# EAGLE schematic rev_a (EAGLE 9.2.2)

## Sheet 1 of 2
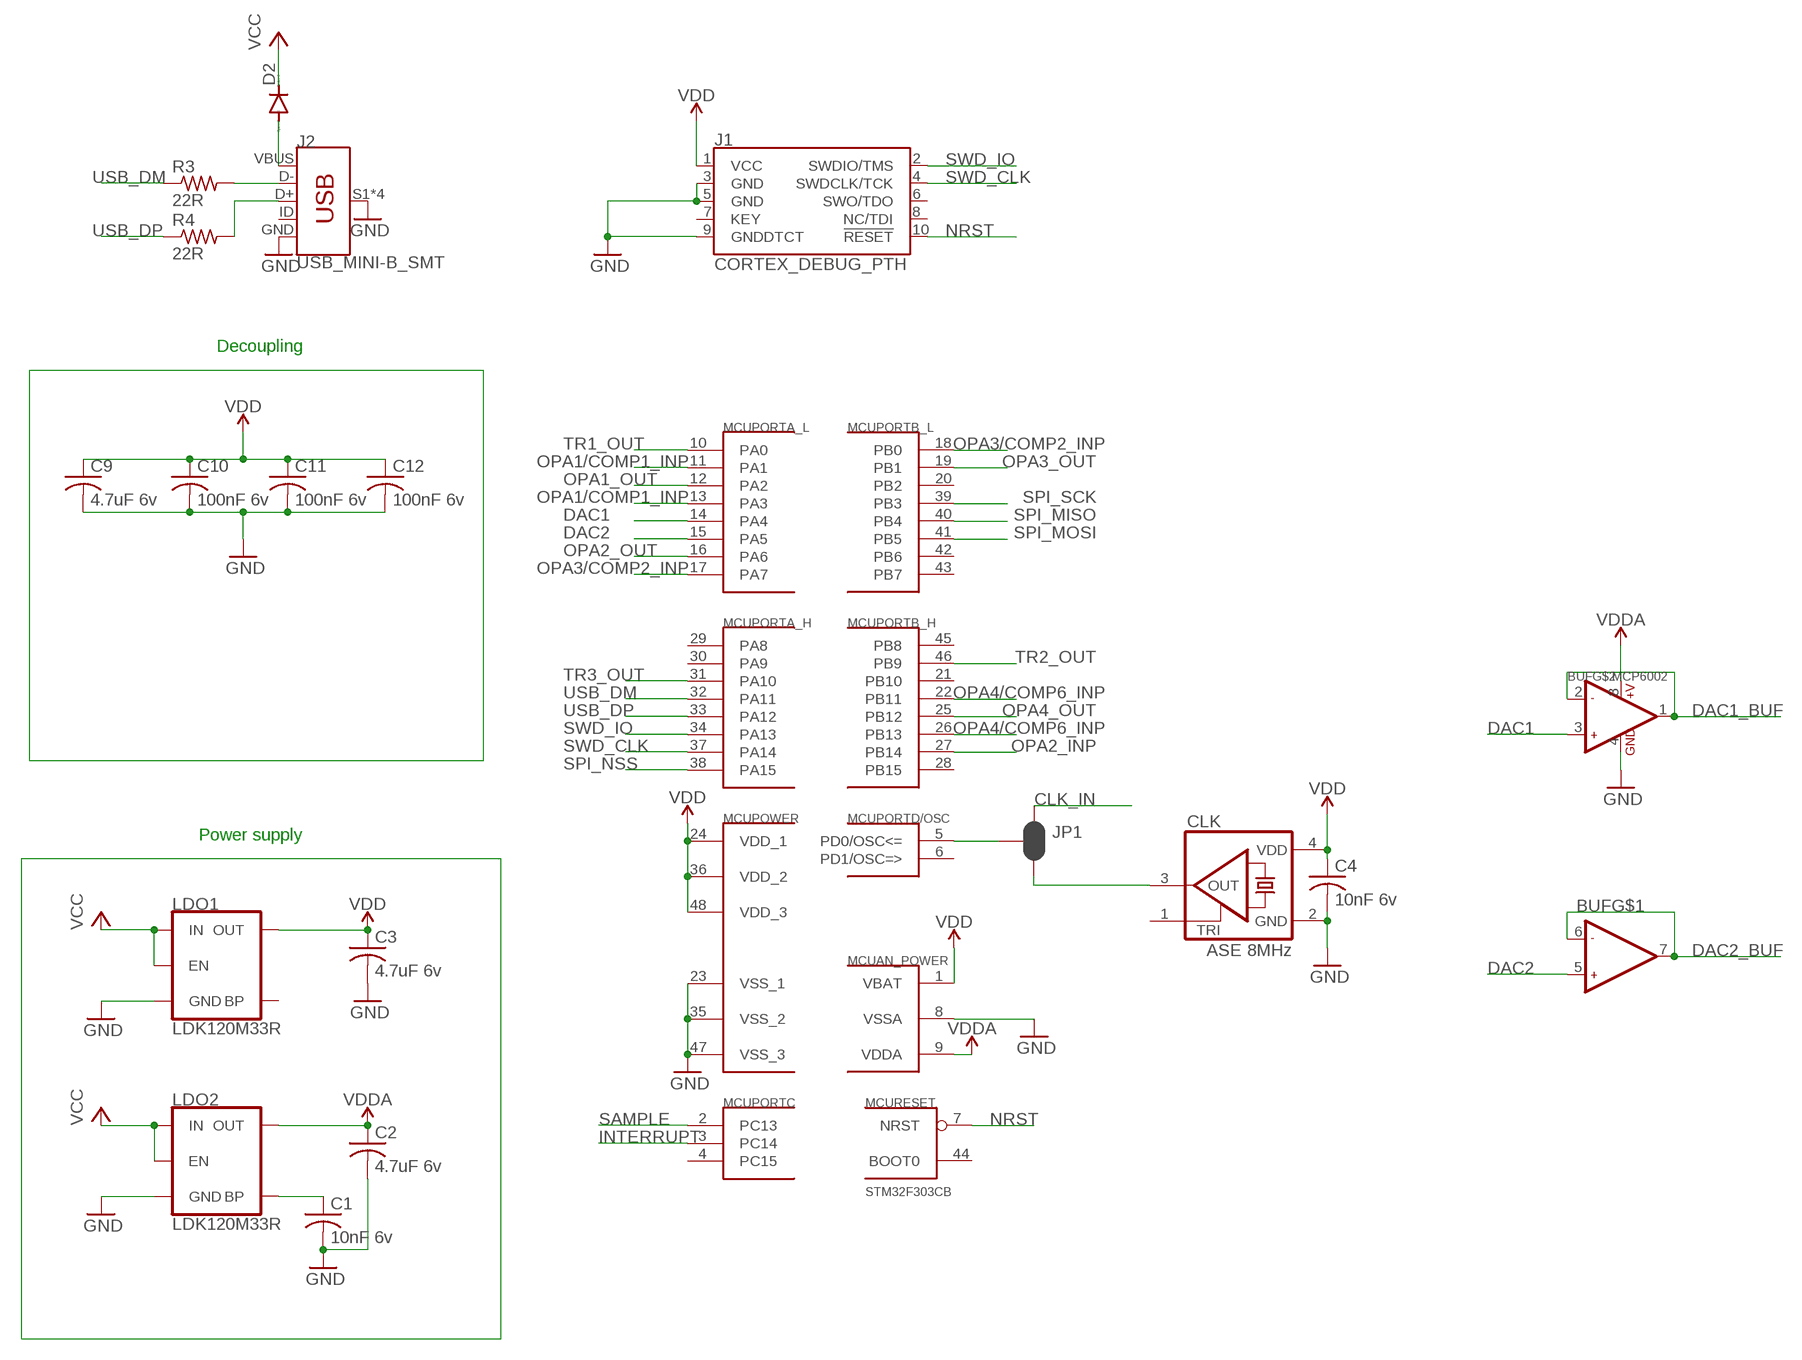
[diagram p0: schematic, sheet 1]

### Parts
BUF  MCP6002  AMPLIFIER-LMV358IDGKR(MSOP8)  [MSOP8-0.65-3X3MM]
C1  10nF 6v  C-USC0805  [C0805]
C2  4.7uF 6v  C-USC0805  [C0805]
C3  4.7uF 6v  C-USC0805  [C0805]
C4  10nF 6v  C-USC0805  [C0805]
C9  4.7uF 6v  C-USC0805  [C0805]
C10  100nF 6v  C-USC0805  [C0805]
C11  100nF 6v  C-USC0805  [C0805]
C12  100nF 6v  C-USC0805  [C0805]
CLK  ASE 8MHz  ASE  [ASE]
D2  DIODE-SOD323-R  [SOD323-R]
J1  CORTEX_DEBUG_PTH  [2X5-PTH-1.27MM]
J2  USB_MINI-B_SMT  [USB-MINIB]
JP1  JUMPER-SMT_3_2-NC_PASTE_SILK  [SMT-JUMPER_3_2-NC_PASTE_SILK]
LDO1  LDK120M33R  V_REG_MIC52053.3V  [SOT23-5]
LDO2  LDK120M33R  V_REG_MIC52053.3V  [SOT23-5]
MCU  STM32F303CB  STM32F10XCXT6  [LQFP48_2]
R3  22R  R-US_R0805  [R0805]
R4  22R  R-US_R0805  [R0805]

### Nets
CLK_IN: JP1.1
DAC1: BUF.3(+IN1) MCU.14(PORTA_L:PA4)
DAC1_BUF: BUF.1(OUT1) BUF.2(-IN1) ; also sheet 2
DAC2: BUF.5(+IN2) MCU.15(PORTA_L:PA5)
DAC2_BUF: BUF.6(-IN2) BUF.7(OUT2)
GND: BUF.4(GND) C1.2 C2.2 C3.2 C4.2 C9.2 C10.2 C11.2 C12.2 CLK.2(GND) J1.3(GND) J1.5(GND) J1.9(GNDDTCT) J2.GND J2.S1(SHIELD) J2.S2(SHIELD) J2.S3(SHIELD) J2.S4(SHIELD) LDO1.2(GND) LDO2.2(GND) MCU.8(AN_POWER:VSSA) MCU.23(POWER:VSS_1) MCU.35(POWER:VSS_2) MCU.47(POWER:VSS_3) ; also sheet 2
INTERRUPT: MCU.3(PORTC:PC14)
N$1: C1.1 LDO2.4(BP)
N$2: C4.1 CLK.4(VDD) ; supply symbol labelled VDD
N$3: J2.D+ R4.2
N$4: J2.D- R3.2
N$5: D2.A J2.VBUS
N$7: CLK.3(OUT) JP1.3
N$9: JP1.2 MCU.5(PORTD/OSC:PD0/OSC<=)
NRST: J1.10(!RESET) MCU.7(RESET:NRST)
OPA1/COMP1_INP: MCU.11(PORTA_L:PA1) MCU.13(PORTA_L:PA3) ; also sheet 2
OPA1_OUT: MCU.12(PORTA_L:PA2)
OPA2_INP: MCU.27(PORTB_H:PB14) ; also sheet 2
OPA2_OUT: MCU.16(PORTA_L:PA6)
OPA3/COMP2_INP: MCU.17(PORTA_L:PA7) MCU.18(PORTB_L:PB0) ; also sheet 2
OPA3_OUT: MCU.19(PORTB_L:PB1)
OPA4/COMP6_INP: MCU.22(PORTB_H:PB11) MCU.26(PORTB_H:PB13) ; also sheet 2
OPA4_OUT: MCU.25(PORTB_H:PB12)
SAMPLE: MCU.2(PORTC:PC13)
SPI_MISO: MCU.40(PORTB_L:PB4)
SPI_MOSI: MCU.41(PORTB_L:PB5)
SPI_NSS: MCU.38(PORTA_H:PA15)
SPI_SCK: MCU.39(PORTB_L:PB3)
SWD_CLK: J1.4(SWDCLK/TCK) MCU.37(PORTA_H:PA14)
SWD_IO: J1.2(SWDIO/TMS) MCU.34(PORTA_H:PA13)
TR1_OUT: MCU.10(PORTA_L:PA0)
TR2_OUT: MCU.46(PORTB_H:PB9)
TR3_OUT: MCU.31(PORTA_H:PA10)
USB_DM: MCU.32(PORTA_H:PA11) R3.1
USB_DP: MCU.33(PORTA_H:PA12) R4.1
VCC: D2.C LDO1.1(IN) LDO1.3(EN) LDO2.1(IN) LDO2.3(EN)
VDD: C3.1 C9.1 C10.1 C11.1 C12.1 J1.1(VCC) LDO1.5(OUT) MCU.1(AN_POWER:VBAT) MCU.24(POWER:VDD_1) MCU.36(POWER:VDD_2) MCU.48(POWER:VDD_3)
VDDA: BUF.8(+V) C2.1 LDO2.5(OUT) MCU.9(AN_POWER:VDDA) ; also sheet 2
Unconnected: CLK.1(TRI) J1.6(SWO/TDO) J1.7(KEY) J1.8(NC/TDI) J2.ID LDO1.4(BP) MCU.4(PORTC:PC15) MCU.6(PORTD/OSC:PD1/OSC=>) MCU.20(PORTB_L:PB2) MCU.21(PORTB_H:PB10) MCU.28(PORTB_H:PB15) MCU.29(PORTA_H:PA8) MCU.30(PORTA_H:PA9) MCU.42(PORTB_L:PB6) MCU.43(PORTB_L:PB7) MCU.44(RESET:BOOT0) MCU.45(PORTB_H:PB8)

### Notes on the sheet
- Decoupling
- Power supply

## Sheet 2 of 2
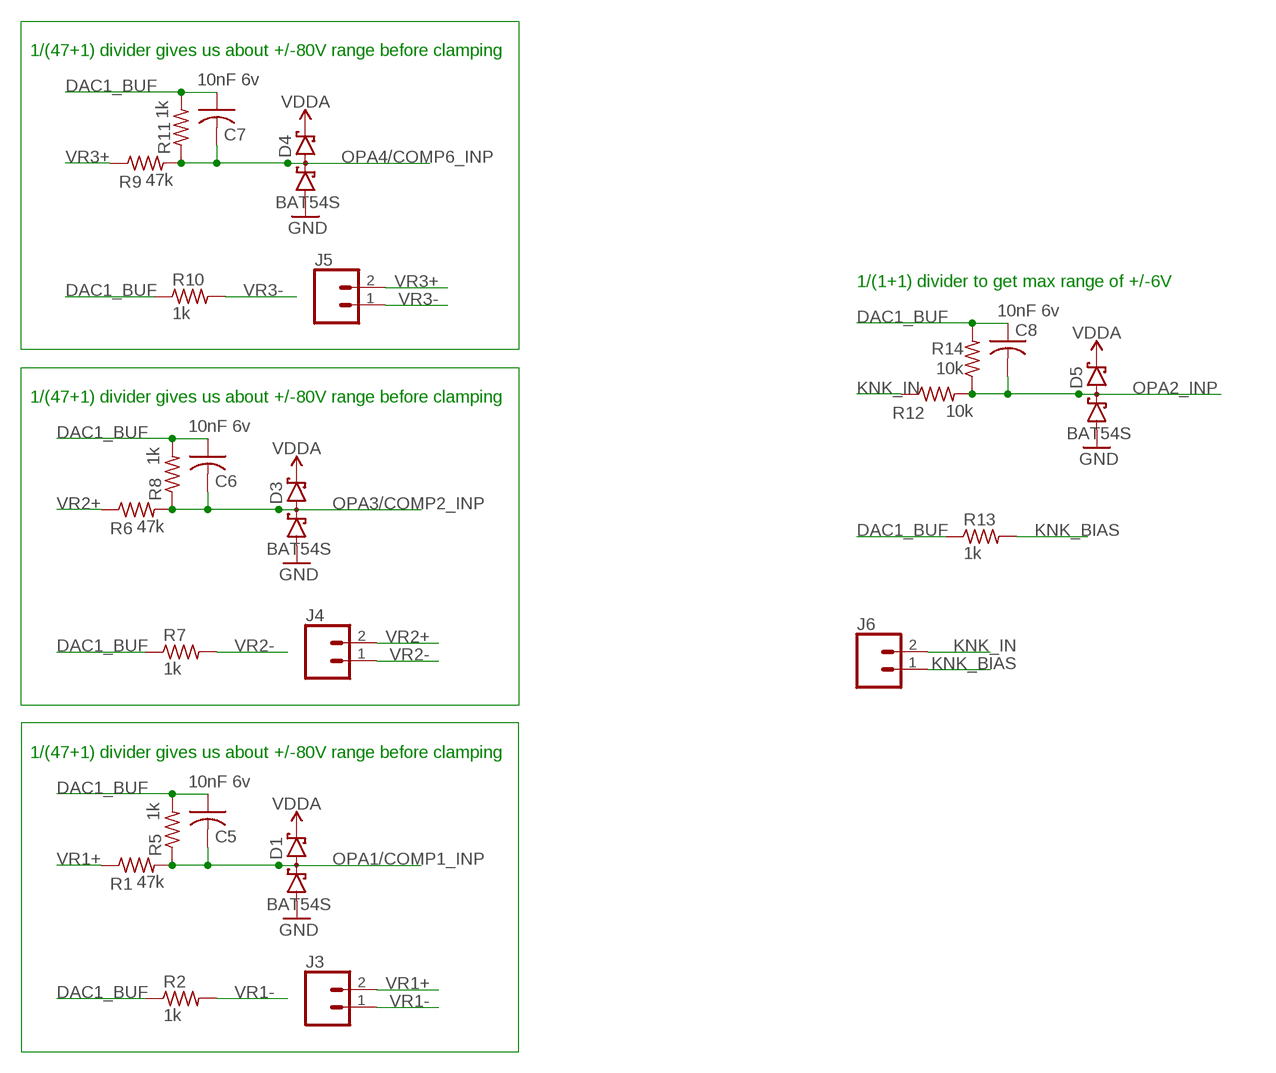
[diagram p1: schematic, sheet 2]

### Parts
C5  10nF 6v  C-USC0805  [C0805]
C6  10nF 6v  C-USC0805  [C0805]
C7  10nF 6v  C-USC0805  [C0805]
C8  10nF 6v  C-USC0805  [C0805]
D1  BAT54S  [SOT23]
D3  BAT54S  [SOT23]
D4  BAT54S  [SOT23]
D5  BAT54S  [SOT23]
J3  CONN_02LOCK  [1X02_LOCK]
J4  CONN_02LOCK  [1X02_LOCK]
J5  CONN_02LOCK  [1X02_LOCK]
J6  CONN_02LOCK  [1X02_LOCK]
R1  47k  R-US_R0805  [R0805]
R2  1k  R-US_R0805  [R0805]
R5  1k  R-US_R0805  [R0805]
R6  47k  R-US_R0805  [R0805]
R7  1k  R-US_R0805  [R0805]
R8  1k  R-US_R0805  [R0805]
R9  47k  R-US_R0805  [R0805]
R10  1k  R-US_R0805  [R0805]
R11  1k  R-US_R0805  [R0805]
R12  10k  R-US_R0805  [R0805]
R13  1k  R-US_R0805  [R0805]
R14  10k  R-US_R0805  [R0805]

### Nets
DAC1_BUF: C5.1 C6.1 C7.1 C8.1 R2.1 R5.2 R7.1 R8.2 R10.1 R11.2 R13.1 R14.2 ; also sheet 1
GND: D1.1(A1) D3.1(A1) D4.1(A1) D5.1(A1) ; also sheet 1
KNK_BIAS: J6.1 R13.2
KNK_IN: J6.2 R12.1
OPA1/COMP1_INP: C5.2 D1.3(C1A2) R1.2 R5.1 ; also sheet 1
OPA2_INP: C8.2 D5.3(C1A2) R12.2 R14.1 ; also sheet 1
OPA3/COMP2_INP: C6.2 D3.3(C1A2) R6.2 R8.1 ; also sheet 1
OPA4/COMP6_INP: C7.2 D4.3(C1A2) R9.2 R11.1 ; also sheet 1
VDDA: D1.2(C2) D3.2(C2) D4.2(C2) D5.2(C2) ; also sheet 1
VR1+: J3.2 R1.1
VR1-: J3.1 R2.2
VR2+: J4.2 R6.1
VR2-: J4.1 R7.2
VR3+: J5.2 R9.1
VR3-: J5.1 R10.2

### Notes on the sheet
- 1/(47+1) divider gives us about +/-80V range before clamping
- 1/(1+1) divider to get max range of +/-6V
- 1/(47+1) divider gives us about +/-80V range before clamping
- 1/(47+1) divider gives us about +/-80V range before clamping

## Library data of the parts
BUF = Seeed-IC:AMPLIFIER-LMV358IDGKR(MSOP8): 310020007; MPN: LMV358IDGKR; VALUE: LMV358IDGKR-MSOP8
C1-C12 = rcl:C-US: CAPACITOR, American symbol; SPICEPREFIX: C
CLK = crystal:ASE: 3.3Vdc CMOS SMD CRYSTAL CLOCK OSCILLATOR SOurce: www.abracon.com; OC_FARNELL: unknown; OC_NEWARK: unknown
D1 D3-D5 = diode:BAT54S: Schottky Diodes Pin connection corrected 2011-05-04 Source: Fairchild .. BAT54.pdf
D2 = diode:DIODE-: DIODE
J1 = SparkFun-Connectors:CORTEX_DEBUG: Cortex Debug Connector - 10 pin Supports JTAG debug, Serial Wire debug, and Serial Wire Viewer. PTH and SMD connector options available. General Connector Information <http://infocenter.arm.com/help/topic/com.arm.doc.faqs/attached/13634/cortex_debug_connectors.pdf> Products: PTH Connector <http://www.digikey.com/product-detail/en/cnc-tech/3220-10-0100-00/1175-1627-ND/3883661> -via Digi-Key SparkFun PSoc <https://www.sparkfun.com/products/13229> SparkFun T <https://www.sparkfun.com/products/13810>
J2 = SparkFun-Connectors:USB_MINI-B: USB type Mini-B Connector Breaks out 5th pin, and includes shield pins if needed. SparkFun Products: SparkFun FTDI Basic Breakout <https://www.sparkfun.com/products/9716> SparkFun XBee Explorer USB <https://www.sparkfun.com/products/11812> SparkFun Redboard <https://www.sparkfun.com/products/12757>; PROD_ID: CONN-08193; SF_ID: PRT-00587
J3-J6 = SparkFun-Connectors:CONN_02: Multi connection point. Often used as Generic Header-pin footprint for 0.1 inch spaced/style header connections On any of the 0.1 inch spaced packages, you can populate with these: Break Away Headers - Straight <https://www.sparkfun.com/products/116> (PRT-00116) Break Away Male Headers - Right Angle <https://www.sparkfun.com/products/553> (PRT-00553) Female Headers <https://www.sparkfun.com/products/115> (PRT-00115) Break Away Headers - Machine Pin <https://www.sparkfun.com/products/117> (PRT-00117) Break Away Female Headers - Swiss Machine Pin <https://www.sparkfun.com/products/743> (PRT-00743) For SCREWTERMINALS and SPRING TERMINALS visit here: Screw Terimnals on SparkFun.com <https://www.sparkfun.com/search/results?term=Screw+Terminals> (5mm/3.5mm/2.54mm spacing) This device is also useful as a general connection point to wire up your design to another part of your project. Our various solder wires solder well into these plated through hole pads. Hook-Up Wire - Assortment (Stranded, 22 AWG) <https://www.sparkfun.com/products/11375> (PRT-11375) Hook-Up Wire - Assortment (Solid Core, 22 AWG) <https://www.sparkfun.com/products/11367> (PRT-11367) View the entire wire category on our website here <https://www.sparkfun.com/categories/141> Special notes: Molex polarized connector foot print use with: PRT-08233 with associated crimp pins and housings. 2.54_SCREWTERM for use with PRT-10571. 3.5mm Screw Terminal footprints for PRT-08084 5mm Screw Terminal footprints for use with PRT-08432
JP1 = SparkFun-Jumpers:JUMPER-SMT_3_2-NC_PASTE: Normally closed solder jumper (2 of 2 connections) This jumper has an aperture in the stencil to allow solder paste to bridge both connections. Both connections are normally closed (NC). Wick off the solder to open the connection(s). Reapply solder to reclose the connection(s).
LDO1 LDO2 = SparkFun-IC-Power:V_REG_MIC5205: V_REG MIC5205 Standard 3.3V, 5V, and Adjustable 150mA LDO voltage regulator in SOT-23 layout. Micrel part MIC5205. BP (by-pass) pin is used to lower output noise with 470pF cap, may be left open. On the adjustable version BP is used to set output.; PROD_ID: VREG-00822; VALUE: 3.3V/150mA
MCU = stm32:STM32F10XCXT6: ST STM32F101/103 48pin LQFP
R1-R14 = rcl:R-US_: RESISTOR, American symbol; SPICEPREFIX: R